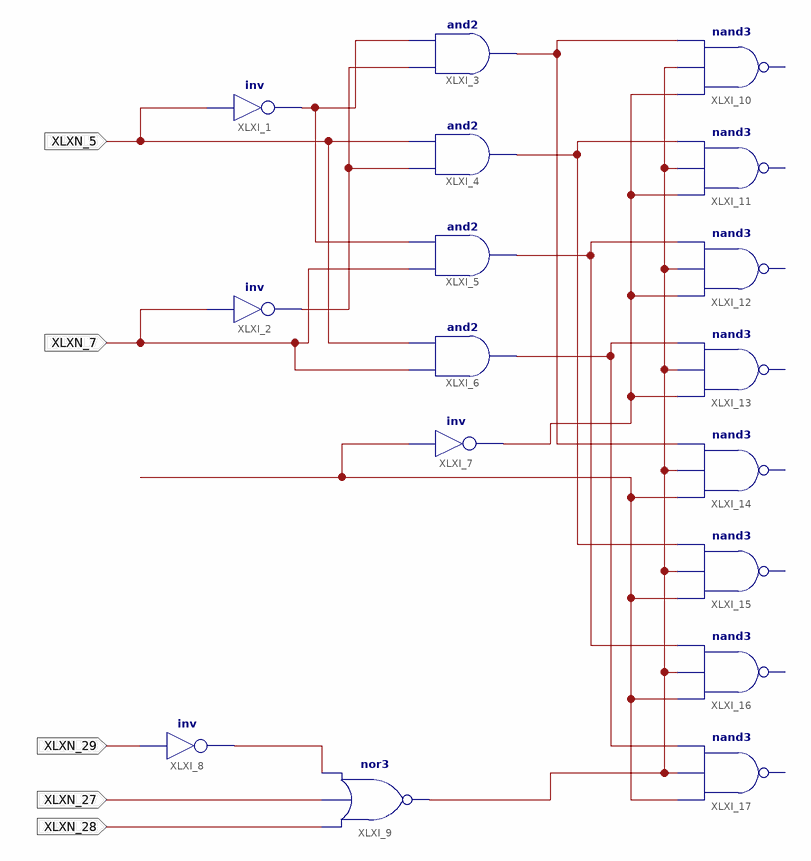
[diagram p0: schematic sheet 1]
// Xilinx ISE schematic D_74LS138.sch (kintex7) as structural Verilog: 17 symbols, 5 ports
module D_74LS138 (
  input  XLXN_5,
  input  XLXN_7,
  input  XLXN_27,
  input  XLXN_28,
  input  XLXN_29
);

  wire XLXN_2, XLXN_6, XLXN_14, XLXN_16, XLXN_18, XLXN_20, XLXN_23, XLXN_24, XLXN_26, XLXN_30;

  not XLXI_1 (XLXN_2, XLXN_5);
  not XLXI_2 (XLXN_6, XLXN_7);
  and XLXI_3 (XLXN_14, XLXN_6, XLXN_2);
  and XLXI_4 (XLXN_16, XLXN_6, XLXN_5);
  and XLXI_5 (XLXN_18, XLXN_7, XLXN_2);
  and XLXI_6 (XLXN_20, XLXN_7, XLXN_5);
  not XLXI_7 (XLXN_23, XLXN_24);
  not XLXI_8 (XLXN_26, XLXN_29);
  nor XLXI_9 (XLXN_30, XLXN_28, XLXN_27, XLXN_26);
  // nand3 XLXI_10 has open pins: I0=XLXN_23, I1=XLXN_30, I2=XLXN_14, O=open
  // nand3 XLXI_11 has open pins: I0=XLXN_23, I1=XLXN_30, I2=XLXN_16, O=open
  // nand3 XLXI_12 has open pins: I0=XLXN_23, I1=XLXN_30, I2=XLXN_18, O=open
  // nand3 XLXI_13 has open pins: I0=XLXN_23, I1=XLXN_30, I2=XLXN_20, O=open
  // nand3 XLXI_14 has open pins: I0=XLXN_24, I1=XLXN_30, I2=XLXN_14, O=open
  // nand3 XLXI_15 has open pins: I0=XLXN_24, I1=XLXN_30, I2=XLXN_16, O=open
  // nand3 XLXI_16 has open pins: I0=XLXN_24, I1=XLXN_30, I2=XLXN_18, O=open
  // nand3 XLXI_17 has open pins: I0=XLXN_24, I1=XLXN_30, I2=XLXN_20, O=open
endmodule
